# EAGLE design Lily_Pad_VGA_Fly v1.01 (EAGLE 9.5.1)
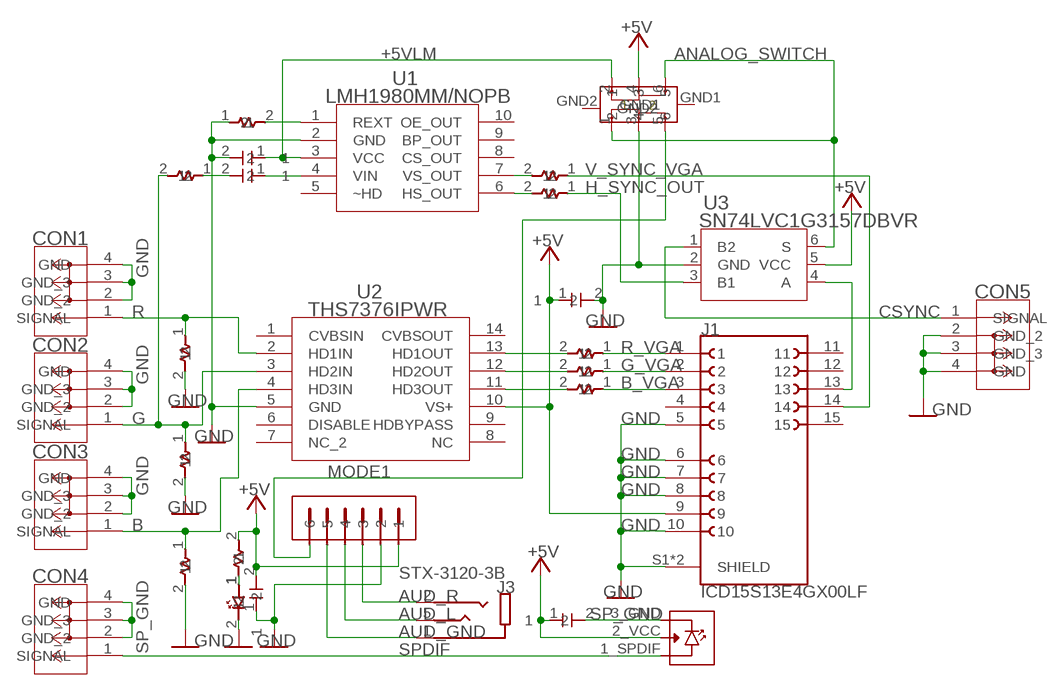
[diagram p0: schematic, sheet 1]

## Parts
C1  22UF  CAPACITOR0603  [CAPACITOR_SMT_0603]
C2  0.1UF  CAPACITOR0603  [CAPACITOR_SMT_0603]
C3  0.1UF  CAPACITOR0603  [CAPACITOR_SMT_0603]
C4  0.1UF  CAPACITOR0603  [CAPACITOR_SMT_0603]
C5  0.1UF  CAPACITOR0603  [CAPACITOR_SMT_0603]
CON1  CONMHF1-SMD-G-T  [COAX3_CONMHF1-SMD-G-T_TEC]
CON2  CONMHF1-SMD-G-T  [COAX3_CONMHF1-SMD-G-T_TEC]
CON3  CONMHF1-SMD-G-T  [COAX3_CONMHF1-SMD-G-T_TEC]
CON4  CONMHF1-SMD-G-T  [COAX3_CONMHF1-SMD-G-T_TEC]
CON5  CONMHF1-SMD-G-T  [COAX3_CONMHF1-SMD-G-T_TEC]
J1  ICD15S13E4GX00LF  [ICD15S13E4GX00LF]
J2  0530470610  [0530470610]
J3  STX-3120-3B  [KYCON_STX-3120-3B]
J4  GQ-1504_OPTICAL  [GQ-1504_OPTICAL]
LED1  LED  [LED_SMT_0603]
R1  75R  RESISTOR0603  [RESISTOR_SMT_0603]
R2  75R  RESISTOR0603  [RESISTOR_SMT_0603]
R3  75R  RESISTOR0603  [RESISTOR_SMT_0603]
R4  75R  RESISTOR0603  [RESISTOR_SMT_0603]
R5  75R  RESISTOR0603  [RESISTOR_SMT_0603]
R6  75R  RESISTOR0603  [RESISTOR_SMT_0603]
R7  91R  RESISTOR0603  [RESISTOR_SMT_0603]
R8  100R  RESISTOR0603  [RESISTOR_SMT_0603]
R9  100R  RESISTOR0603  [RESISTOR_SMT_0603]
RA  1K  RESISTOR0603  [RESISTOR_SMT_0603]
RB  10K  RESISTOR0603  [RESISTOR_SMT_0603]
SW1  DPDT_SW_SK22D07  [DPDT_SK22D07]
U1  LMH1980MM/NOPB  [MUB10A]
U2  THS7376IPWR  [PW14_TEX]
U3  SN74LVC1G3157DBVR  [DBV6]

## Nets
+5V: C1.2 C4.1 C5.1 J1.9 J2.1 J4.2_VCC RA.2 SW1.4 U2.10(VS+) U3.5(VCC)
+5VLM: C2.1 SW1.2 U1.3(VCC)
ANALOG_SWITCH: SW1.1 SW1.6 U3.6(S)
AUD_GND: J2.5 J3.1
AUD_L: J2.4 J3.5
AUD_R: J2.3 J3.2
B: CON3.1(SIGNAL) R1.1 U2.4(HD3IN)
B_OUT: R4.2 U2.11(HD3OUT)
B_VGA: J1.3 R4.1
CSYNC: CON5.1(SIGNAL) U3.1(B2)
G: CON2.1(SIGNAL) R2.1 R8.2 U2.3(HD2IN)
G_OUT: R5.2 U2.12(HD2OUT)
G_SYNC1: C3.2 R8.1
G_SYNC2: C3.1 U1.4(VIN)
G_VGA: J1.2 R5.1
GND: C1.1 C2.2 C4.2 CON1.2(GND_2) CON1.3(GND_3) CON1.4(GND) CON2.2(GND_2) CON2.3(GND_3) CON2.4(GND) CON3.2(GND_2) CON3.3(GND_3) CON3.4(GND) CON5.2(GND_2) CON5.3(GND_3) CON5.4(GND) J1.5 J1.6 J1.7 J1.8 J1.10 J1.S1(SHIELD) J1.S2(SHIELD) J2.2 LED1.2 R1.2 R2.2 R3.2 RB.1 SW1.3 U1.2(GND) U2.5(GND) U3.2(GND)
H_SYNC_OUT: R7.1 U3.3(B1)
H_SYNC_SPLIT: R7.2 U1.6(HS_OUT)
H_SYNC_VGA: J1.13 U3.4(A)
LED: LED1.1 RA.1
MODE1: J2.6 SW1.5
R: CON1.1(SIGNAL) R3.1 U2.2(HD1IN)
R_OUT: R6.2 U2.13(HD1OUT)
R_VGA: J1.1 R6.1
REF: RB.2 U1.1(REXT)
SP_GND: C5.2 CON4.2(GND_2) CON4.3(GND_3) CON4.4(GND) J4.3_GND
SPDIF: CON4.1(SIGNAL) J4.1_SPDIF
V_SYNC_SPLIT: R9.2 U1.7(VS_OUT)
V_SYNC_VGA: J1.14 R9.1
Unconnected: J1.4 J1.11 J1.12 J1.15 SW1.GND1 SW1.GND2 U1.5(~HD) U1.8(CS_OUT) U1.9(BP_OUT) U1.10(OE_OUT) U2.1(CVBSIN) U2.6(DISABLE) U2.7(NC_2) U2.8(NC) U2.9(HDBYPASS) U2.14(CVBSOUT)

## Library data of the parts
C1-C5 = Xbox VGA:CAPACITOR: various capacitors
CON1-CON5 = Xbox VGA:CONMHF1-SMD-G-T; COPYRIGHT: Copyright (C) 2024 Ultra Librarian. All rights reserved.; MANUFACTURER_PART_NUMBER: CONMHF1-SMD-G-T; MFR_NAME: TE Connectivity; TYPE: Coaxial Connectors(RF) Assemblies
J1 = Xbox VGA:ICD15S13E4GX00LF; MANUFACTURER: Amphenol; MAXIMUM_PACKAGE_HEIGHT: 12.96mm; PARTREV: G; STANDARD: Manufacturer Recommendations
J2 = Xbox VGA:0530470610
J3 = Xbox VGA:STX-3120-3B; MANUFACTURER: KYCON; MAXIMUM_PACKAGE_HEIGHT: 10.5 mm; PARTREV: B3; STANDARD: Manufacturer recommendations
J4 = Xbox VGA:GQ-1504_OPTICAL
LED1 = Xbox VGA:LED
R1-R9 RA RB = Xbox VGA:RESISTOR: various resistors
SW1 = Xbox VGA:DPDT_SW_SK22D07
U1 = Xbox VGA:LMH1980MM/NOPB; COPYRIGHT: Copyright (C) 2024 Ultra Librarian. All rights reserved.; MANUFACTURER_PART_NUMBER: LMH1980MM/NOPB; MFR_NAME: Texas Instruments
U2 = Xbox VGA:THS7376IPWR; COPYRIGHT: Copyright (C) 2024 Ultra Librarian. All rights reserved.; MANUFACTURER_PART_NUMBER: THS7376IPWR; MFR_NAME: Texas Instruments
U3 = Xbox VGA:SN74LVC1G3157DBVR; COPYRIGHT: Copyright (C) 2025 Ultra Librarian. All rights reserved.; MANUFACTURER_PART_NUMBER: SN74LVC1G3157DBVR; MFR_NAME: Texas Instruments

## Board
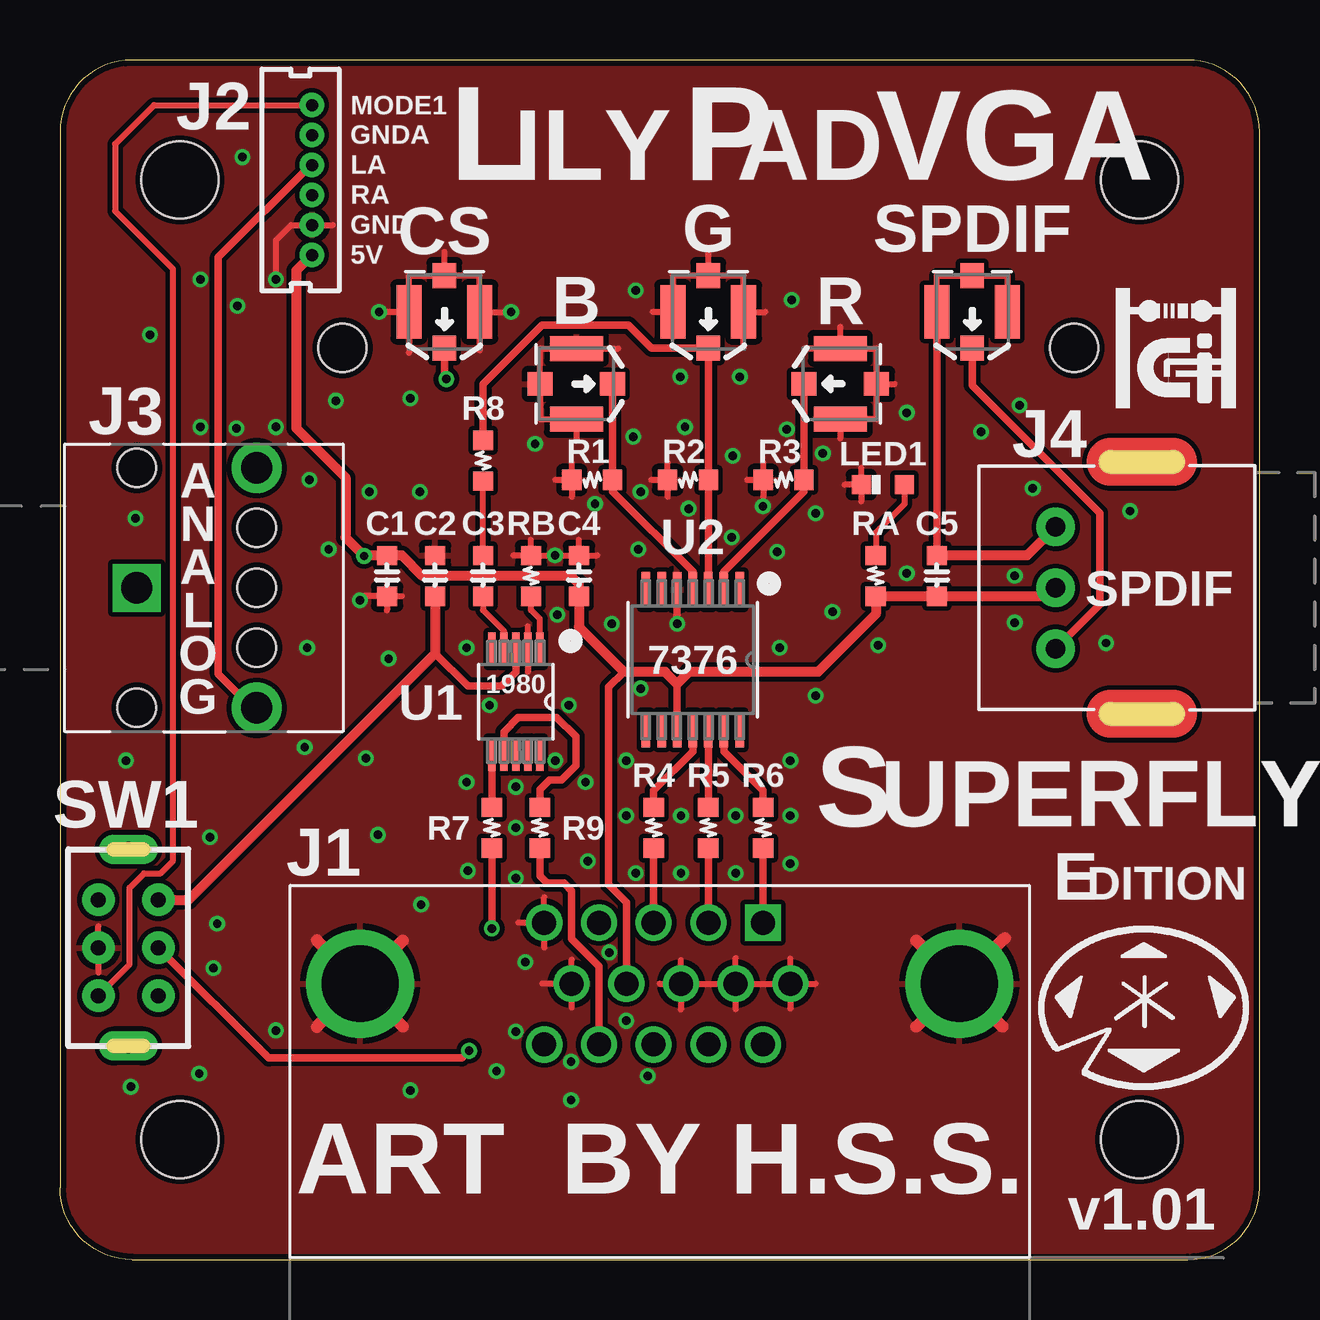
[diagram p1: board, top side]
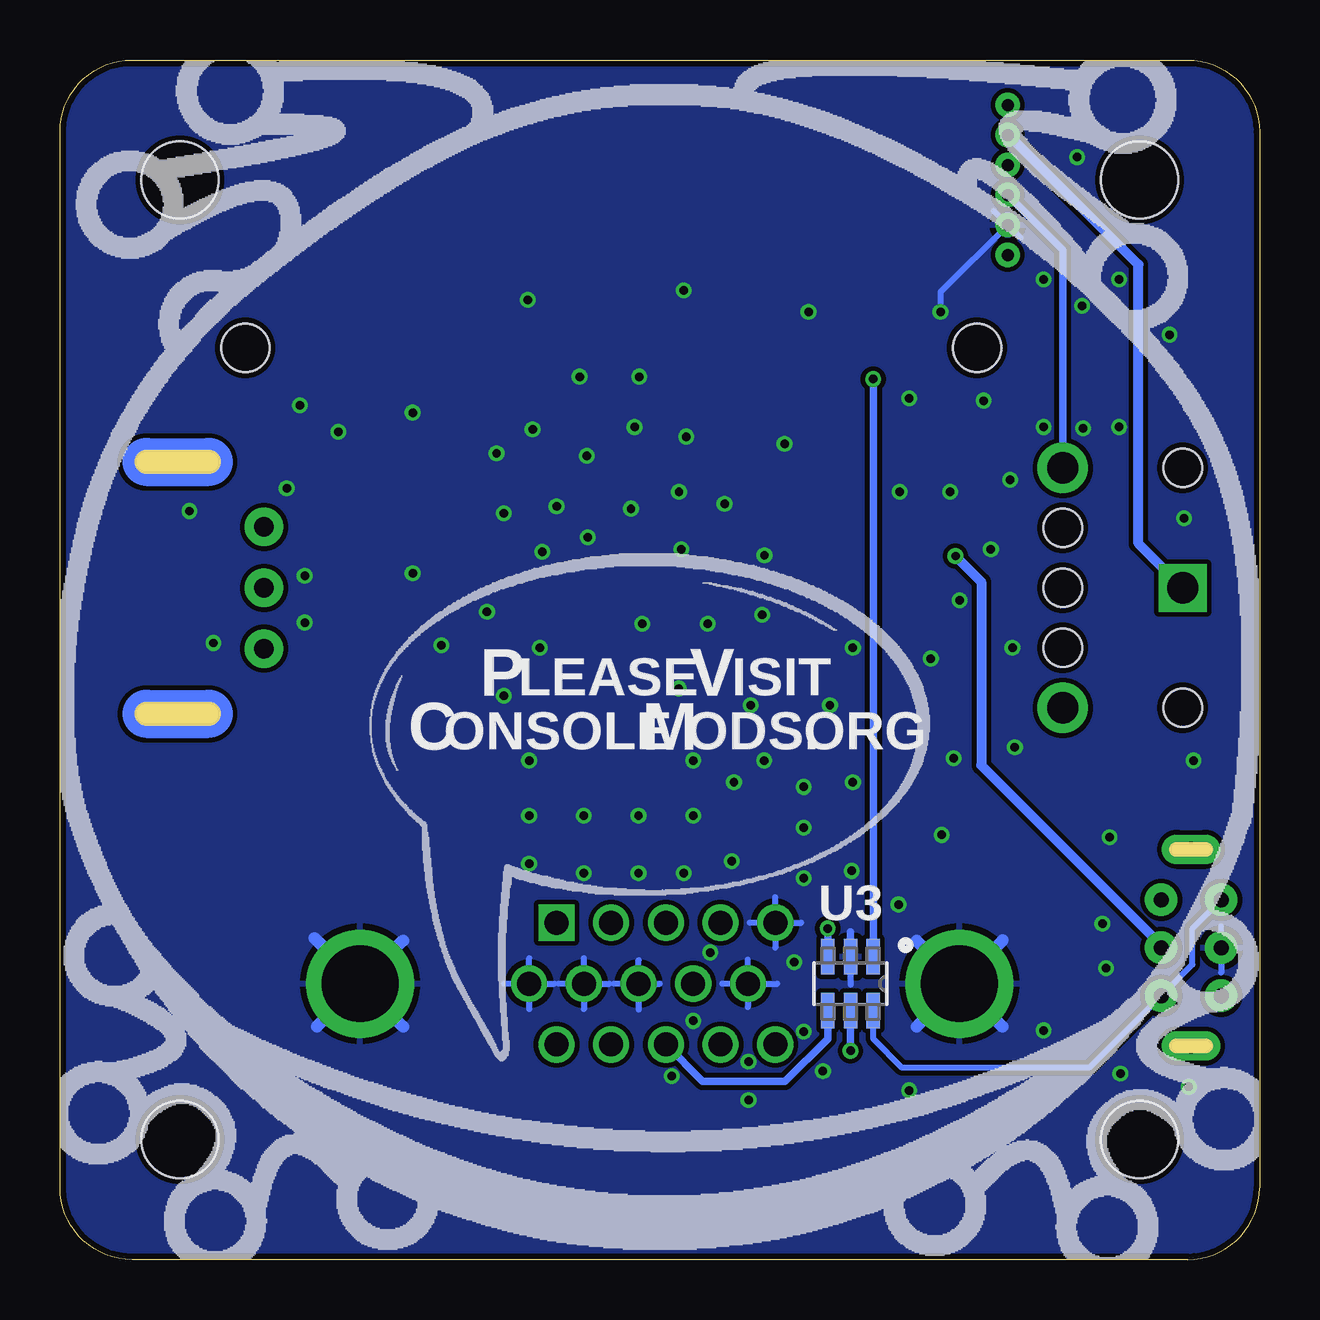
[diagram p2: board, bottom side, seen from below]

Size 50 x 50 mm. Coordinates in mm from the lower left corner, seen from the top.
Outline: 3,0 47,0 arc90 50,3 50,47 arc90 47,50 3,50 arc90 0,47 0,3 arc90 3,0
Copper layers (1*16): Top 0.035mm / dielectric 1.5mm / Bottom 0.035mm
Design rules "pcbway-20170911": minimum track width 6mil, minimum drill 0.3mm, track to track 6mil, track to pad 6mil, pad to pad 6mil, via to via 6mil, smd to smd 0mil, copper to edge 10mil, drill to drill 10mil, minimum pad ring 10mil, minimum via ring 6mil, stop-mask expansion 2mil, vias tented up to drill 100mil, thermal gap 10mil
Holes 2 mm at 11.78,38 42.27,38
Holes 3.2 mm at 5,45 45,5 45,45 5,5

### Footprints (pad centres in the part's own frame; a part is rotated, then mirrored left to right if it is on the bottom)
CAPACITOR_SMT_0603 = smd 0.8 x 0.85: 1 0.85,0; 2 -0.85,0
COAX3_CONMHF1-SMD-G-T_TEC = smd 0.991 x 1.041: 1 0,1.511; 4 0,-1.511 | smd 1.041 x 2.21: 2 -1.473,0; 3 1.473,0
ICD15S13E4GX00LF = drill 1 square: 1 4.305,2.54 | drill 1: 2 2.025,2.54; 3 -0.255,2.54; 4 -2.535,2.54; 5 -4.815,2.54; 6 5.445,0; 7 3.165,0; 8 0.885,0; 9 -1.395,0; 10 -3.675,0; 11 4.305,-2.54; 12 2.025,-2.54; 13 -0.255,-2.54; 14 -2.535,-2.54; 15 -4.815,-2.54 | drill 3.2 pad 4.5: S1 -12.495,0; S2 12.495,0
0530470610 = drill 0.5 pad 1: 1 3.125,0; 2 1.875,0; 3 0.625,0; 4 -0.625,0; 5 -1.875,0; 6 -3.125,0
KYCON_STX-3120-3B = drill 1.3 pad 2 square: 1 0,0 | drill 1.3 pad 2.1: 2 5,5; 5 5,-5 | hole 1.6: 0,5; 0,-5; 5,0; 5,2.5; 5,-2.5
GQ-1504_OPTICAL = drill 0.8 pad 1.6: 1_SPDIF 2.54,-3.6; 2_VCC 0,-3.6; 3_GND -2.54,-3.6
LED_SMT_0603 = smd 0.8 x 0.8: 1 0.9,0; 2 -0.9,0
RESISTOR_SMT_0603 = smd 0.8 x 0.85: 1 0.85,0; 2 -0.85,0
DPDT_SK22D07 = drill 0.625 pad 1.35: 1 2,1.25; 2 2,-1.25; 3 0,1.25; 4 0,-1.25; 5 -2,1.25; 6 -2,-1.25 | drill 0.61 pad 1.22 long: GND1 4.1,0; GND2 -4.1,0
MUB10A = smd 1.372 x 0.33: 1 -2.197,1; 2 -2.197,0.5; 3 -2.197,0; 4 -2.197,-0.5; 5 -2.197,-1; 6 2.197,-1; 7 2.197,-0.5; 8 2.197,0; 9 2.197,0.5; 10 2.197,1
PW14_TEX = smd 1.473 x 0.356: 1 -2.921,1.95; 2 -2.921,1.3; 3 -2.921,0.65; 4 -2.921,0; 5 -2.921,-0.65; 6 -2.921,-1.3; 7 -2.921,-1.95; 8 2.921,-1.95; 9 2.921,-1.3; 10 2.921,-0.65; 11 2.921,0; 12 2.921,0.65; 13 2.921,1.3; 14 2.921,1.95
DBV6 = smd 1.473 x 0.559: 1 -1.118,0.95; 2 -1.118,0; 3 -1.118,-0.95; 4 1.118,-0.95; 5 1.118,0; 6 1.118,0.95

### Placement (x,y rotation side)
C1  13.63,28.5 270 top
C2  15.63,28.5 270 top
C3  17.64,28.5 270 top
C4  21.64,28.5 270 top
C5  36.55,28.5 270 top
CON1  32.52,36.5 90 top
CON2  27.02,39.5 180 top
CON3  21.52,36.5 270 top
CON4  38.02,39.5 180 top
CON5  16.02,39.5 180 top
J1  25,11.5 0 top
J2  10.5,45 270 top
J3  3.2,28 0 top
J4  45.1,28 270 top
LED1  34.3,32.3 0 top
R1  22.19,32.5 0 top
R2  26.18,32.5 0 top
R3  30.16,32.5 0 top
R4  24.75,18 270 top
R5  27.02,18 270 top
R6  29.3,18 270 top
R7  18,18 270 top
R8  17.64,33.3 270 top
R9  20,18 270 top
RA  34,28.5 90 top
RB  19.64,28.5 90 top
SW1  2.85,13 90 top
U1  19,23.25 270 top
U2  26.38,25 270 top
U3  17.05,11.5 270 bottom
U$2  [HCI_LOGO_5MM]  46.5,38 0 top

### Tracks (layer width: path | path; a pad name or v marks a point on that pad's centre or on a via)
+5V  (via drill 0.35)
  Top 0.305: v17.05,8.7 16.75,8.4 8.7,8.4 SW1.4
  Top 0.32: U2.10 25.73,24 | J1.9 23.61,14.89 22.86,15.63 22.86,23.86 23.5,24.5
  Top 0.406: J2.1 9.85,41.23 9.85,34.65 11.9,32.6 11.9,30.1 v12.68,29.32 12.68,29.35 C1.2 14.25,29.35 15.1,28.5 21.3,28.5 21.64,28.16 C4.1 21.64,26.36 23.5,24.5 25.23,24.5 25.73,24 26.23,24.5 31.6,24.5 34,26.9 RA.2 C5.1 41.15,27.65 J4.2_VCC
  Bottom 0.305: U3.5 v17.05,8.7
  Bottom 0.406: v12.68,29.32 11.6,28.25 11.6,20.6 4.1,13.1 SW1.4
+5VLM
  Top 0.32: U1.3 19,24.5 18.4,23.9 17,23.9 15.63,25.27
  Top 0.406: C2.1 15.63,25.27 5.37,15 SW1.2
ANALOG_SWITCH
  Bottom 0.254: U3.6 16.1,9.2 14.9,8 7.1,8 SW1.6 2.8,12.3 2.8,13.8 SW1.1
AUD_GND
  Bottom 0.406: J3.1 5.05,29.85 5.05,41.48 10.45,46.88 J2.5
AUD_L
  Top 0.305: J3.5 8,23 6.6,24.4 6.6,41.77 10.45,45.62 J2.4
AUD_R
  Bottom 0.305: J3.2 8.2,42.08 J2.3
B
  Top 0.32: CON3.1 R1.1 23.04,32.01 26.38,28.68 U2.4
B_OUT
  Top 0.32: R4.2 24.75,19.55 26.38,21.18 U2.11
B_VGA
  Top 0.32: R4.1 J1.3
CSYNC  (via drill 0.35)
  Top 0.32: CON5.1 16.02,36.77 v16.1,36.7
  Bottom 0.32: U3.1 v16.1,36.7
G
  Top 0.32: U2.3 R2.1 CON2.1 24.66,37.99 23.7,38.95 20.1,38.95 17.64,36.48 R8.2
G_OUT
  Top 0.32: R5.2 U2.12
G_SYNC1
  Top 0.254: C3.2 R8.1
G_SYNC2
  Top 0.254: C3.1 17.64,27.07 18.5,26.2 U1.4
G_VGA
  Top 0.32: J1.2 R5.1
GND  (via drill 0.35)
  Top 0.254: R1.2 21.34,33.2 | R1.2 21.34,31.8 | R1.2 20.65,32.5 | R2.2 25.32,33.2 | R2.2 24.65,32.5 | R2.2 25.32,31.8 | R3.2 29.31,33.2 | R3.2 28.65,32.5 | R3.2 29.31,31.8 | CON1.3 34.04,37.97 CON1.4 | CON1.4 34.04,35.03 CON1.2 32.52,34.23 | 28.5,38 CON2.2 | CON2.2 28.5,41.01 CON2.4 | CON2.4 25.55,41.01 CON2.3 24.7,39.5 | 23.28,37.97 CON3.2 20.01,37.97 CON3.4 20.01,35.03 CON3.3 21.52,34.12 | CON1.3 31.03,37.97 | CON2.2 29.4,39.5 | CON1.3 32.52,38.88 | CON1.4 34.8,36.5 | CON2.4 27.02,41.92 | J1.8 J1.7 | J1.7 J1.6 | 25,11.5 J1.8 | J1.6 31.5,11.5 | J1.8 25.89,12.48 | J1.7 28.16,12.56 | J1.6 30.45,12.54 | J1.8 25.89,10.41 | J1.7 28.16,10.44 | J1.6 30.45,10.46 | 11.38,43.12 J2.2 9.62,43.12 9,42.5 v9,40.85 | CON5.3 14.55,41.01 CON5.4 | CON5.2 17.5,41.01 CON5.4 | CON5.3 14.55,37.8 | CON5.2 17.5,37.9 | CON5.2 18.6,39.5 | CON5.4 16.02,42 | CON5.3 13.5,39.5 | 19.5,26.4 U1.2 19.5,24.5 | J1.5 20.18,15.1 | J1.5 19.1,14.04 | J1.5 20.18,13 | J1.10 20.1,11.5 | J1.10 21.32,12.5 | J1.10 21.32,10.5 | RB.1 19.64,30 | C4.2 21.64,30 | C1.1 13.63,27.5 | RB.1 v20.64,29.35 C4.2 | RB.1 18.9,29.35 | C4.2 22.4,29.35 | LED1.2 32.7,32.3 | LED1.2 33.4,33 | LED1.2 33.4,31.6 | 1.6,13.9 SW1.3 1.6,11.95 | C1.1 12.68,27.65 v12.5,27.48 | C1.1 14.25,27.65 | C1.1 13.63,27.07
  Top 0.32: U2.5 v25.73,26.5
  Top 0.508: J1.S2 35.7,13.3 | J1.S2 39.3,9.7 | J1.S2 39.4,13.4 | J1.S2 35.7,9.7 | J1.S1 10.7,13.3 | J1.S1 14.3,13.29 | J1.S1 10.7,9.7 | J1.S1 14.3,9.71
  Bottom 0.254: J2.2 10.38,43.12 | J2.2 11.07,43.7 | v13.3,39.5 13.3,40.33 J2.2 | J2.2 9.95,42.58 | J1.5 19.1,14.04 | J1.5 20.18,15.1 | J1.5 20.18,13 | J1.10 21.32,12.5 | J1.10 20.1,11.5 | J1.10 22.4,11.5 | J1.5 21.26,14.04 | 1.6,13.9 SW1.3 1.6,11.95 | J1.10 21.32,10.53 | J1.8 26.9,11.5 | J1.8 25,11.5 | J1.7 27.1,11.5 | J1.7 29.2,11.5 | J1.6 29.4,11.5 | J1.6 31.5,11.5 | J1.8 25.89,12.48 | J1.8 25.89,10.41 | J1.7 28.16,12.56 | J1.7 28.16,10.44 | J1.6 30.45,12.55 | J1.6 30.45,10.45 | U3.2 17.05,11.45
  Bottom 0.32: U3.2 17.05,13.65
  Bottom 0.508: J1.S2 35.7,13.3 | J1.S2 39.3,9.7 | J1.S2 35.7,9.7 | J1.S2 39.4,13.4 | J1.S1 10.7,13.3 | J1.S1 10.71,9.7 | J1.S1 14.3,13.29 | J1.S1 14.3,9.71
  other vias: 28.16,18.5 20.73,26.88 25.89,18.5 23.61,18.5 30.45,20.8 23.61,20.8 25.85,36.8 24,40.4 19,18 24.1,29.6 26.2,31.3 29.3,31.4 30.5,40 28.34,36.8 19.8,34 32.2,27 31.5,31.1 38.4,34.5 14.6,35.9 12.9,32 35.3,35.3 22.3,31.5 18.8,39.5 11.5,35.8 10.4,32.5 30.45,18.5 40.55,32.15 19,9.5 16.95,25.5 9,34.7 5.85,34.7 3.75,38.55 23.6,9.95 6.25,17.6 15,32 10.2,21.35 39.8,26.55 7.35,34.65 13.25,17.7 16.95,19.9 19.4,12.4 22,16.6 11.2,29.6 24,16.1 13.7,25.05 20.65,20.8 21.2,23.1 17.91,23.1 21.91,19.9 40,35.6 44.6,31.2 43.6,25.7 10.3,25.5 25.89,16.1 28.16,16.1 30.45,16.5 19,19.7 22.9,12.8 18.2,7.85 6.4,12.15 17,16.2 6.55,14 12.75,20.9 24.5,7.65 15.05,14.8 5.85,40.85 39.8,28.5 35.3,28.6 34.1,25.6 30,25.5 24.2,23.8 31.5,23.5 23,26.5 29.9,29.5 28,30.1 24.2,32 23.9,34.3 30.3,34.6 31.8,33.6 21.3,6.65 3.15,30.9 9,9.55 14.6,7.05 5.8,7.75 21.3,8.25 7.4,39.75 2.75,20.8 2.95,7.2 19,15.9 28.04,33.5 26.05,34.7 7.6,45.95
  pour Top (isolate 0.2): -2,52 52,52 52,-2 -2,-2
  pour Bottom (isolate 0.2): -2,54 54,54 54,-4 -4,-4 -4,4 -4,54
H_SYNC_OUT  (via drill 0.35)
  Top 0.32: R7.1 v18,13.8
  Bottom 0.32: U3.3 v18,13.8
H_SYNC_SPLIT
  Top 0.32: R7.2 U1.6
H_SYNC_VGA
  Bottom 0.32: J1.13 23.21,7.43 19.77,7.43 18,9.2 U3.4
LED
  Top 0.254: RA.1 34,30.3 35.2,31.5 LED1.1
MODE1
  Top 0.254: SW1.5 2.9,12.3 2.9,15.5 3.5,16.1 4.2,16.1 4.72,16.62 4.72,41.28 2.3,43.7 2.3,46.5 3.92,48.12 J2.6
R
  Top 0.32: CON1.1 R3.1 31.01,32.01 28.3,29.3 27.68,28.68 U2.2
R_OUT
  Top 0.32: R6.2 29.3,19.55 27.68,21.18 U2.13
R_VGA
  Top 0.32: R6.1 J1.1
REF
  Top 0.254: U1.1 20,26.7 19.64,27.07 RB.2
SP_GND
  Top 0.254: CON4.3 36.55,41.01 CON4.4 39.5,41.01 CON4.2
  Top 0.305: CON4.3 C5.2
  Top 0.406: J4.3_GND 40.31,29.35 C5.2
SPDIF
  Top 0.305: J4.1_SPDIF 43.34,27.3 43.34,31.12 38.02,36.43 CON4.1
V_SYNC_SPLIT
  Top 0.32: U1.7 18.5,22 19.1,22.6 20.7,22.6 21.5,21.8 21.5,20.6 20.9,20 20.4,20 20,19.6 R9.2
V_SYNC_VGA
  Top 0.32: J1.14 22.46,12.23 21.32,13.37 21.32,15.38 21,15.7 20.3,15.7 20,16 R9.1

### Text on the board
tPlace: MODE1 | J2 | GNDA | LA | L | ILY | P | AD | VGA | RA | GND | 5V | CS | G | SPDIF | B | R | R8 | J3 | R1 | R2 | R3 | LED1 | J4 | A | N | C1 | C2 | C3 | RB | C4 | RA | C5 | A | U2 | SPDIF | L | O | 7376 | G | 1980 | U1 | R4 | R5 | R6 | SW1 | R7 | R9 | S | UPERFLY | J1 | E | DITION | ART BY H.S.S. | v1.01
bPlace: ISIT | V | LEASE | P | ORG | ODS. | M | ONSOLE | C | U3